# EasyEDA schematic Schematic.json
TITLE: Sheet_1; REV: 1.0; Date: 2025-04-05; Sheet: 1/1; Drawn By: anomy; Company: Your Company
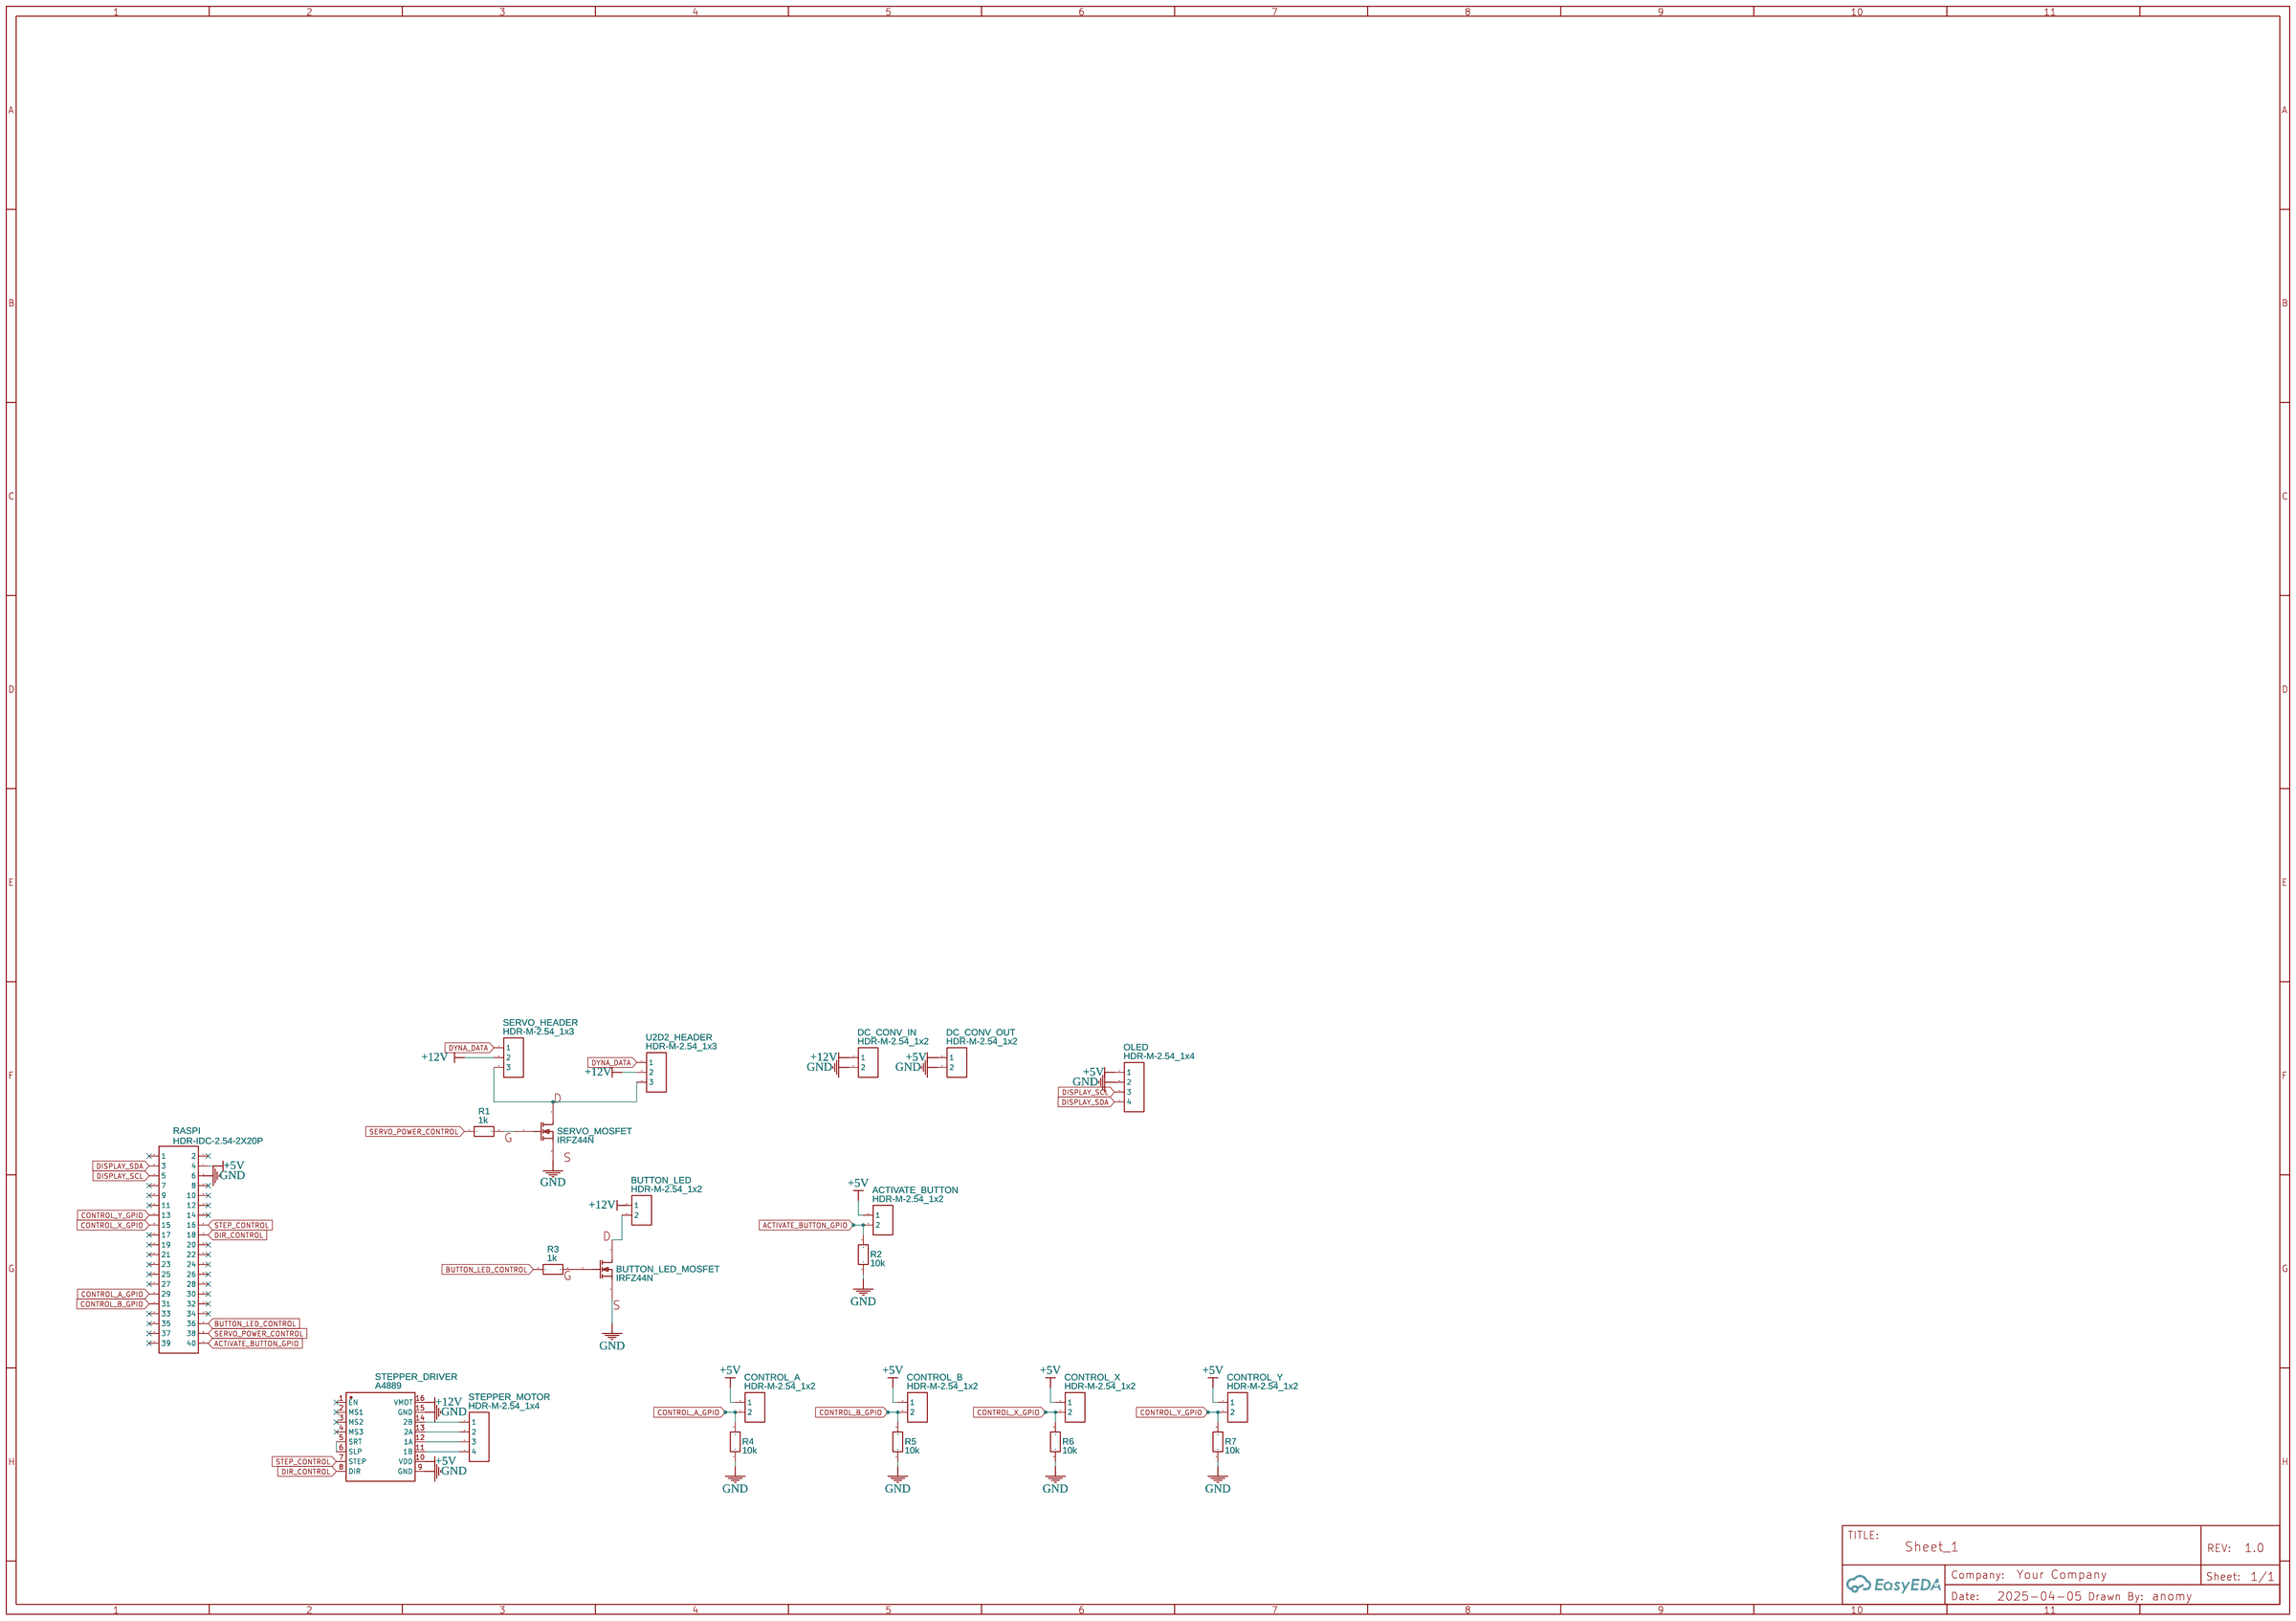
[diagram p0: schematic sheet]

## Parts
ACTIVATE_BUTTON  HDR-M-2.54_1x2  [HDR-M-2.54_1X2]
BUTTON_LED  HDR-M-2.54_1x2  [HDR-M-2.54_1X2]
BUTTON_LED_MOSFET  IRFZ44N  [IRFZ44N]
CONTROL_A  HDR-M-2.54_1x2  [HDR-M-2.54_1X2]
CONTROL_B  HDR-M-2.54_1x2  [HDR-M-2.54_1X2]
CONTROL_X  HDR-M-2.54_1x2  [HDR-M-2.54_1X2]
CONTROL_Y  HDR-M-2.54_1x2  [HDR-M-2.54_1X2]
DC_CONV_IN  HDR-M-2.54_1x2  [HDR-M-2.54_1X2]
DC_CONV_OUT  HDR-M-2.54_1x2  [HDR-M-2.54_1X2]
OLED  HDR-M-2.54_1x4  [HDR-M-2.54_1X4]
R1  1k  [R_AXIAL-0.3]
R2  10k  [R_AXIAL-0.3]
R3  1k  [R_AXIAL-0.3]
R4  10k  [R_AXIAL-0.3]
R5  10k  [R_AXIAL-0.3]
R6  10k  [R_AXIAL-0.3]
R7  10k  [R_AXIAL-0.3]
RASPI  HDR-IDC-2.54-2X20P  [IDC-TH_40P-P2.54_C9138]
SERVO_HEADER  HDR-M-2.54_1x3  [HDR-M-2.54_1X3]
SERVO_MOSFET  IRFZ44N  [IRFZ44N]
STEPPER_DRIVER  A4889  [A4988]
STEPPER_MOTOR  HDR-M-2.54_1x4  [HDR-M-2.54_1X4]
U2D2_HEADER  HDR-M-2.54_1x3  [HDR-M-2.54_1X3]

## Library data of the parts
ACTIVATE_BUTTON BUTTON_LED CONTROL_A CONTROL_B CONTROL_X CONTROL_Y DC_CONV_IN DC_CONV_OUT = HDR-M-2.54_1x2: Supplier Part: C124375; Supplier: LCSC; Contributor: LCEDA_Lib
BUTTON_LED_MOSFET SERVO_MOSFET = IRFZ44N COPY: HEXFET Power MOSFET; Contributor: Brandon Soto
OLED STEPPER_MOTOR = HDR-M-2.54_1x4: Supplier Part: C124378; Supplier: LCSC; Contributor: LCEDA_Lib
R1-R7 = R_AXIAL-0.3_EU: Contributor: LCEDA_Lib
RASPI = HDR-IDC-2.54-2X20P: Supplier: LCSC; Manufacturer: BOOMELE; Manufacturer Part: IDC Box 2X20 2.54MM; image: //image.lceda.cn/szlcsc/C9138.jpg; Supplier Part: C9138
SERVO_HEADER U2D2_HEADER = HDR-M-2.54_1x3: Supplier Part: C180248; Supplier: LCSC; Contributor: LCEDA_Lib
STEPPER_DRIVER = A4889: Contributor: varis_63201910020

## Nets
+5V: ACTIVATE_BUTTON.1 CONTROL_A.1 CONTROL_B.1 CONTROL_X.1 CONTROL_Y.1 DC_CONV_OUT.1 OLED.1 RASPI.4 STEPPER_DRIVER.10(VDD)
+12V: BUTTON_LED.1 DC_CONV_IN.1 SERVO_HEADER.2 STEPPER_DRIVER.16(VMOT) U2D2_HEADER.2
GND: BUTTON_LED_MOSFET.3(S) DC_CONV_IN.2 DC_CONV_OUT.2 OLED.2 R2.1 R4.1 R5.1 R6.1 R7.1 RASPI.6 SERVO_MOSFET.3(S) STEPPER_DRIVER.9(GND) STEPPER_DRIVER.15(GND)
ACTIVATE_BUTTON_GPIO: ACTIVATE_BUTTON.2 R2.2 RASPI.40
BUTTON_LED_CONTROL: R3.1 RASPI.36
CONTROL_A_GPIO: CONTROL_A.2 R4.2 RASPI.29
CONTROL_B_GPIO: CONTROL_B.2 R5.2 RASPI.31
CONTROL_X_GPIO: CONTROL_X.2 R6.2 RASPI.15
CONTROL_Y_GPIO: CONTROL_Y.2 R7.2 RASPI.13
DIR_CONTROL: RASPI.18 STEPPER_DRIVER.8(DIR)
DISPLAY_SCL: OLED.3 RASPI.5
DISPLAY_SDA: OLED.4 RASPI.3
DYNA_DATA: SERVO_HEADER.1 U2D2_HEADER.1
SERVO_POWER_CONTROL: R1.1 RASPI.38
STEP_CONTROL: RASPI.16 STEPPER_DRIVER.7(STEP)
Net-(BUTTON_LED-2): BUTTON_LED.2 BUTTON_LED_MOSFET.2(D)
Net-(BUTTON_LED_MOSFET-1): BUTTON_LED_MOSFET.1(G) R3.2
Net-(R1-2): R1.2 SERVO_MOSFET.1(G)
Net-(SERVO_HEADER-3): SERVO_HEADER.3 SERVO_MOSFET.2(D) U2D2_HEADER.3
Net-(STEPPER_DRIVER-5): STEPPER_DRIVER.5(SRT) STEPPER_DRIVER.6(SLP)
Net-(STEPPER_DRIVER-11): STEPPER_DRIVER.11(1B) STEPPER_MOTOR.4
Net-(STEPPER_DRIVER-12): STEPPER_DRIVER.12(1A) STEPPER_MOTOR.3
Net-(STEPPER_DRIVER-13): STEPPER_DRIVER.13(2A) STEPPER_MOTOR.2
Net-(STEPPER_DRIVER-14): STEPPER_DRIVER.14(2B) STEPPER_MOTOR.1

Not connected (* = marked no-connect by the designer): RASPI 1* 2* 7* 8* 9* 10* 11* 12* 14* 17* 19* 20* 21* 22* 23* 24* 25* 26* 27* 28* 30* 32* 33* 34* 35* 37* 39*; STEPPER_DRIVER 1(EN)* 2(MS1)* 3(MS2)* 4(MS3)*
